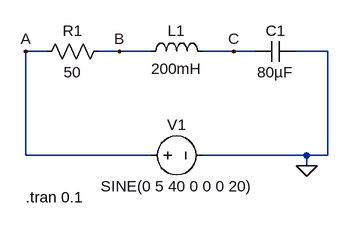
[diagram p0: schematic RLC.asc]
RLC.asc, the LTspice schematic file:
Version 4
SHEET 1 880 680
WIRE -112 48 -144 48
WIRE 0 48 -32 48
WIRE 48 48 0 48
WIRE 176 48 128 48
WIRE 208 48 176 48
WIRE 320 48 272 48
WIRE -144 208 -144 48
WIRE 48 208 -144 208
WIRE 288 208 128 208
WIRE 320 208 320 48
WIRE 320 208 288 208
WIRE 288 224 288 208
FLAG 288 224 0
FLAG -144 48 A
FLAG 0 48 B
FLAG 176 48 C
SYMBOL res -128 64 R270
WINDOW 0 32 56 VTop 2
WINDOW 3 0 56 VBottom 2
SYMATTR InstName R1
SYMATTR Value 50
SYMBOL ind 32 64 R270
WINDOW 0 32 56 VTop 2
WINDOW 3 5 56 VBottom 2
SYMATTR InstName L1
SYMATTR Value 200mH
SYMBOL cap 208 64 R270
WINDOW 0 32 32 VTop 2
WINDOW 3 0 32 VBottom 2
SYMATTR InstName C1
SYMATTR Value 80µF
SYMBOL voltage 32 208 R270
WINDOW 0 32 56 VTop 2
WINDOW 3 -32 56 VBottom 2
WINDOW 123 0 0 Left 0
WINDOW 39 0 0 Left 0
SYMATTR InstName V1
SYMATTR Value SINE(0 5 40 0 0 0 20)
TEXT -144 272 Left 2 !.tran 0.1

The netlist it stands for:
* RLC.asc
R1 A B 50
L1 B C 200mH
C1 C 0 80µF
V1 A 0 SINE(0 5 40 0 0 0 20)
.tran 0.1
.backanno
.end